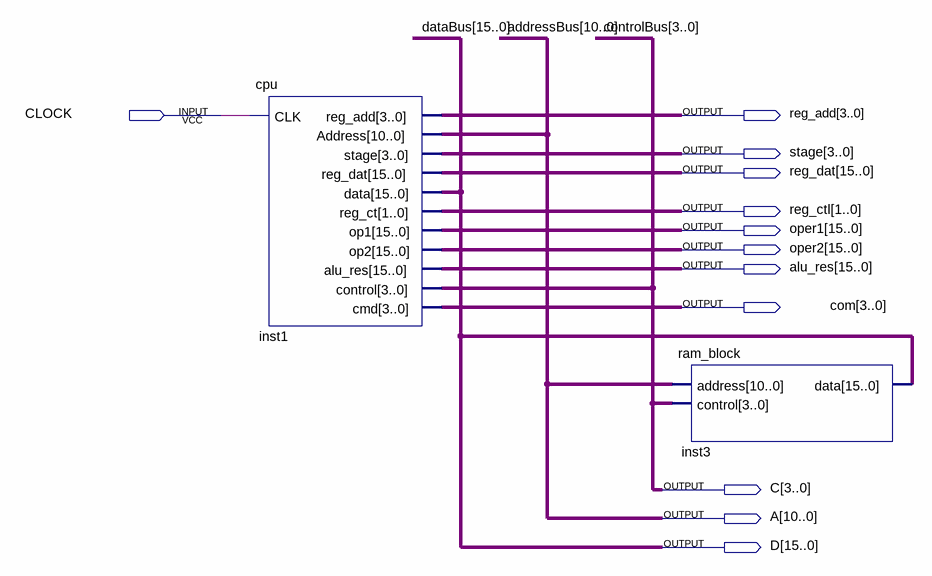
[diagram p0: schematic sheet]
// Quartus schematic pc.bdf as structural Verilog: 2 symbols, 12 pins
module pc (
  input  CLOCK,
  output [3:0] reg_add,
  output [3:0] stage,
  output [15:0] reg_dat,
  output [1:0] reg_ctl,
  output [15:0] oper1,
  output [15:0] oper2,
  output [15:0] alu_res,
  output [3:0] com,
  output [3:0] C,
  output [10:0] A,
  output [15:0] D
);

  cpu inst1 (
    .CLK(CLOCK), .reg_add(reg_add), .Address(A), .stage(stage), .reg_dat(reg_dat), .reg_ct(reg_ctl),
    .op1(oper1), .op2(oper2), .alu_res(alu_res), .control(C), .cmd(com), .data(D));
  ram_block inst3 (.address(A), .control(C), .data(D));

  // Other names for the same wires on the sheet: addressBus[10:0] = A; controlBus[3:0] = C; dataBus[15:0] = D
endmodule
